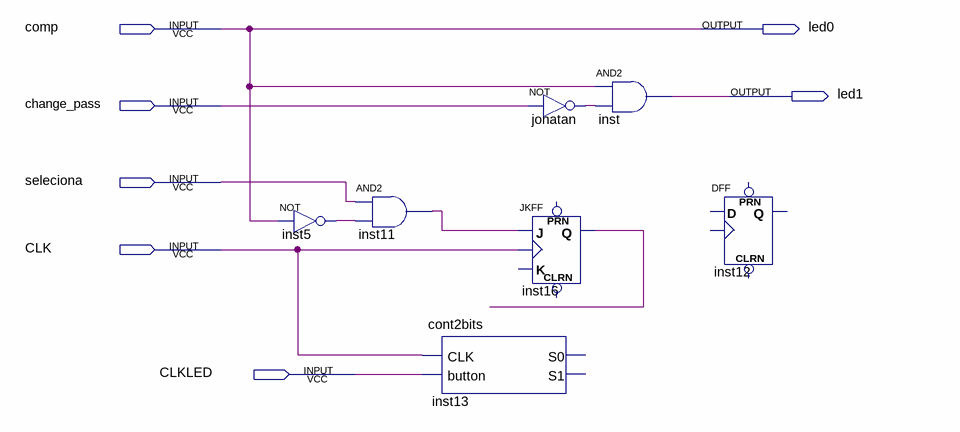
[diagram p0: schematic sheet]
// Quartus schematic leds.bdf as structural Verilog: 7 symbols, 7 pins
module leds (
  input  comp,
  input  change_pass,
  input  seleciona,
  input  CLK,
  input  CLKLED,
  output led0,
  output led1
);

  wire inst5_out, inst11_out, inst16_q, jonatan_out;

  not inst5 (inst5_out, comp);
  and inst11 (inst11_out, seleciona, inst5_out);
  cont2bits inst13 (.CLK(CLK), .button(CLKLED));  // open: S0, S1
  not jonatan (jonatan_out, change_pass);
  JKFF inst16 (.J(inst11_out), .CLK(CLK), .Q(inst16_q));  // open: PRN, CLRN, K
  and inst (led1, comp, jonatan_out);
  DFF inst12 ();  // open: CLRN, CLK, D, PRN, Q

  assign led0 = comp;
endmodule
